# Altium schematic sheet GeneratedSystem-07.SchDoc
size 101 x 76 mm
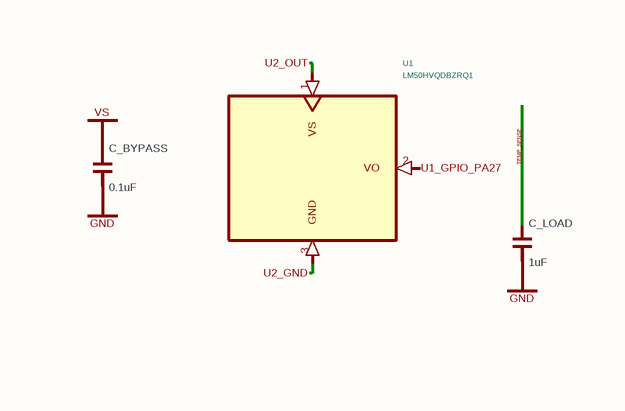
[diagram p0: GeneratedSystem-07.SchDoc]

## Parts
C_BYPASS  0.1uF
C_LOAD  1uF
U1  (no value)

## Nets
GND: C_BYPASS.2(cathode) C_LOAD.2(cathode)
VS: C_BYPASS.1(anode)
U1_GPIO_PA27: U1.2(VO)
U2_GND: U1.3(GND)
U2_OUT: U1.1(VS)

Not connected (* = marked no-connect by the designer): C_LOAD 1(anode)

## Notes on the sheet
- TEMP_SENSE
- (in symbol U1) LM50HVQDBZRQ1

## Library data of the parts
C_BYPASS C_LOAD = capacitor_down
U1 = U1